# Altium schematic sheet DSP_Block.SchDoc
size A4; SheetNumber: 4; SheetTotal: 4
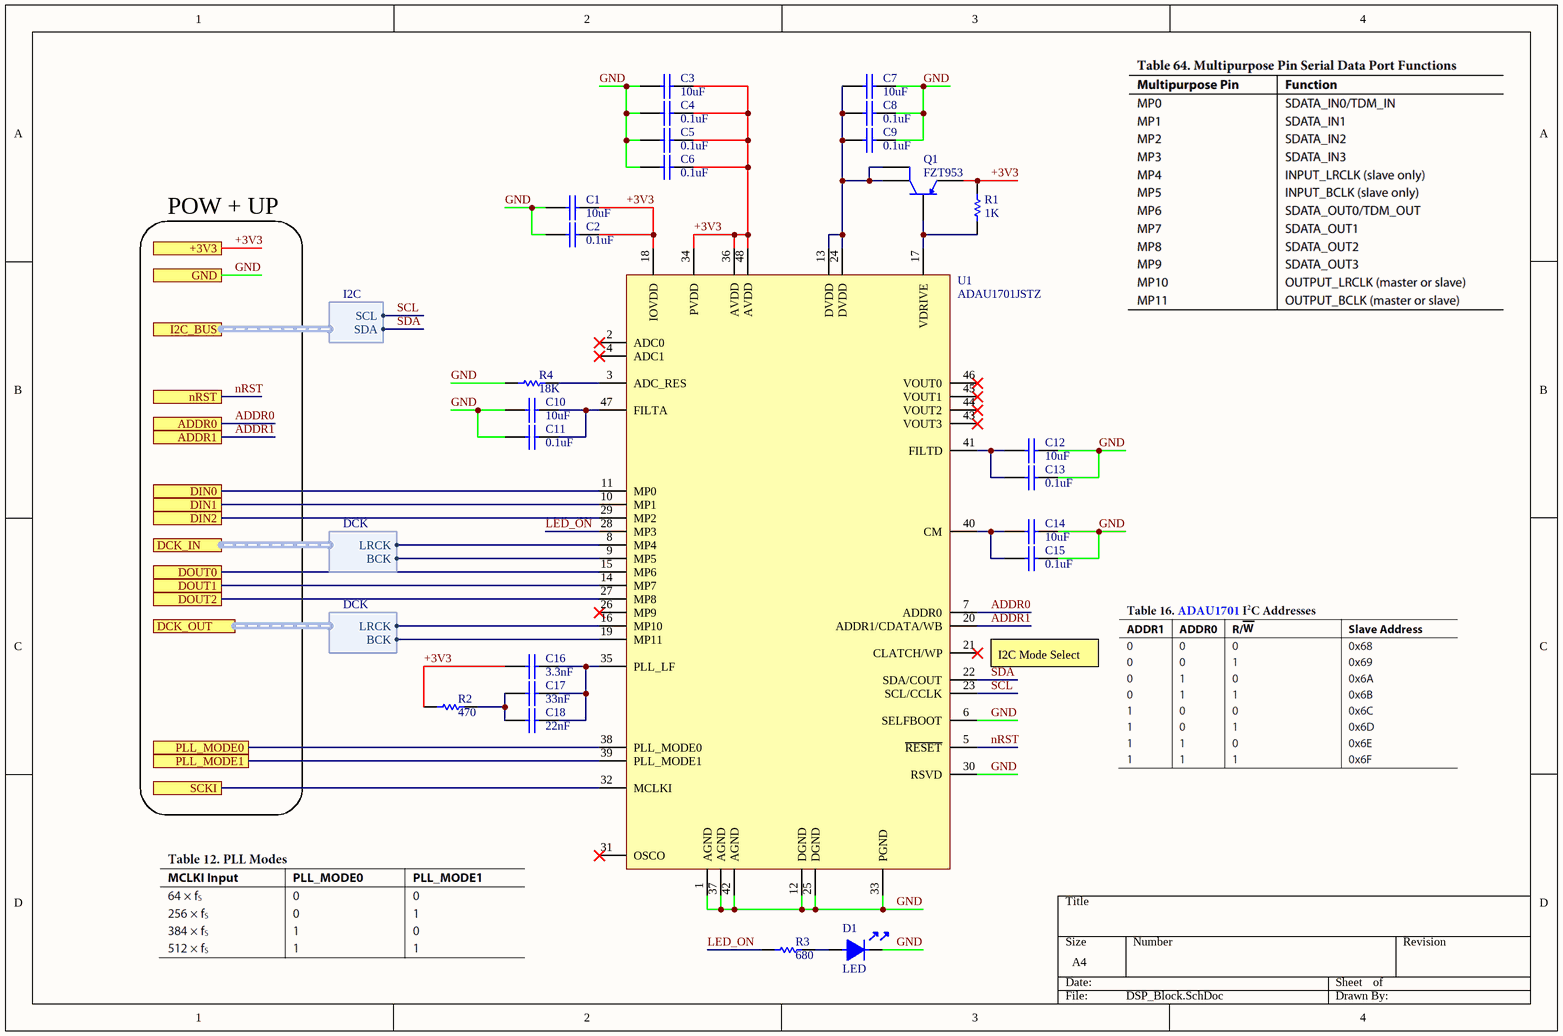
[diagram p0: DSP_Block.SchDoc]

## Parts
C1  10uF  [0603-CAP-TDK]
C2  0.1uF  [0402-CAP-TDK]
C3  10uF  [0603-CAP-TDK]
C4  0.1uF  [0402-CAP-TDK]
C5  0.1uF  [0402-CAP-TDK]
C6  0.1uF  [0402-CAP-TDK]
C7  10uF  [0603-CAP-TDK]
C8  0.1uF  [0402-CAP-TDK]
C9  0.1uF  [0402-CAP-TDK]
C10  10uF  [0603-CAP-TDK]
C11  0.1uF  [0402-CAP-TDK]
C12  10uF  [0603-CAP-TDK]
C13  0.1uF  [0402-CAP-TDK]
C14  10uF  [0603-CAP-TDK]
C15  0.1uF  [0402-CAP-TDK]
C16  3.3nF  [0402-CAP-TDK]
C17  33nF  [0603-CAP-TDK]
C18  22nF  [0603-CAP-TDK]
D1  LED  [LED-0805]
Q1  FZT953  [SOT223-DN]
R1  1K  [0402-RES-PANASONIC]
R2  470  [0402-RES-PANASONIC]
R3  680  [0402-RES-PANASONIC]
R4  18K  [0402-RES-PANASONIC]
U1  ADAU1701JSTZ  [LQFP-48 - ST-48]

## Ports
+3V3 (see AudioDSP-v2.0_top[2A]), ADDR0, ADDR1, DCK_IN (harness DCK), DCK_OUT (harness DCK), DIN0, DIN1, DIN2, DOUT0, DOUT1, DOUT2, GND (see AudioDSP-v2.0_top[2B]), I2C_BUS (harness I2C, see AudioDSP-v2.0_top[2B]), nRST, PLL_MODE0, PLL_MODE1, SCKI

## Harnesses
I2C: SCL, SDA
DCK: BCK, LRCK

## Nets
+3V3: C1.1 C2.1 C3.1 C4.1 C5.1 C6.1 C16.1 Q1.E R1.2 R2.1 U1.18(IOVDD) U1.34(PVDD) U1.36(AVDD) U1.48(AVDD) ; port +3V3
ADDR0: U1.7(ADDR0) ; port ADDR0
ADDR1: U1.20(ADDR1/CDATA/WB) ; port ADDR1
DIN0: U1.11(MP0) ; port DIN0
DIN1: U1.10(MP1) ; port DIN1
DIN2: U1.29(MP2) ; port DIN2
DOUT0: U1.15(MP6) ; port DOUT0
DOUT1: U1.14(MP7) ; port DOUT1
DOUT2: U1.27(MP8) ; port DOUT2
GND: C1.2 C2.2 C3.2 C4.2 C5.2 C6.2 C7.1 C8.1 C9.1 C10.2 C11.2 C12.1 C13.1 C14.1 C15.1 D1.2 R4.1 U1.1(AGND) U1.6(SELFBOOT) U1.12(DGND) U1.25(DGND) U1.30(RSVD) U1.33(PGND) U1.37(AGND) U1.42(AGND) ; port GND
LED_ON: R3.1 U1.28(MP3)
nRST: U1.5(~{RESET}) ; port nRST
PLL_MODE0: U1.38(PLL_MODE0) ; port PLL_MODE0
PLL_MODE1: U1.39(PLL_MODE1) ; port PLL_MODE1
SCKI: U1.32(MCLKI) ; port SCKI
SCL: U1.23(SCL/CCLK) ; port I2C_BUS.SCL
SDA: U1.22(SDA/COUT) ; port I2C_BUS.SDA
NetC7_2: C7.2 C8.2 C9.2 Q1.C Q1.C-TAB U1.13(DVDD) U1.24(DVDD)
NetC10_1: C10.1 C11.1 U1.47(FILTA)
NetC12_2: C12.2 C13.2 U1.41(FILTD)
NetC14_2: C14.2 C15.2 U1.40(CM)
NetC16_2: C16.2 C17.2 C18.2 U1.35(PLL_LF)
NetC17_1: C17.1 C18.1 R2.2
NetD1_1: D1.1 R3.2
NetQ1_B: Q1.B R1.1 U1.17(VDRIVE)
NetR4_2: R4.2 U1.3(ADC_RES)
NetU1_8: U1.8(MP4) ; port DCK_IN.LRCK
NetU1_9: U1.9(MP5) ; port DCK_IN.BCK
NetU1_16: U1.16(MP10) ; port DCK_OUT.LRCK
NetU1_19: U1.19(MP11) ; port DCK_OUT.BCK

Not connected (* = marked no-connect by the designer): U1 2(ADC0)* 4(ADC1)* 21(CLATCH/WP)* 26(MP9)* 31(OSCO)* 43(VOUT3)* 44(VOUT2)* 45(VOUT1)* 46(VOUT0)*

## Notes on the sheet
- POW + UP
- (near U1) I2C Mode Select

## Library data of the parts
C1-C18 = CAP-SMD
D1 = LED-SMD
R1-R4 = RES-SMD
U1 = ADAU1701JSTZ: SigmaDSP 28-/56-Bit Audio Processor with Two ADCs and Four DACs